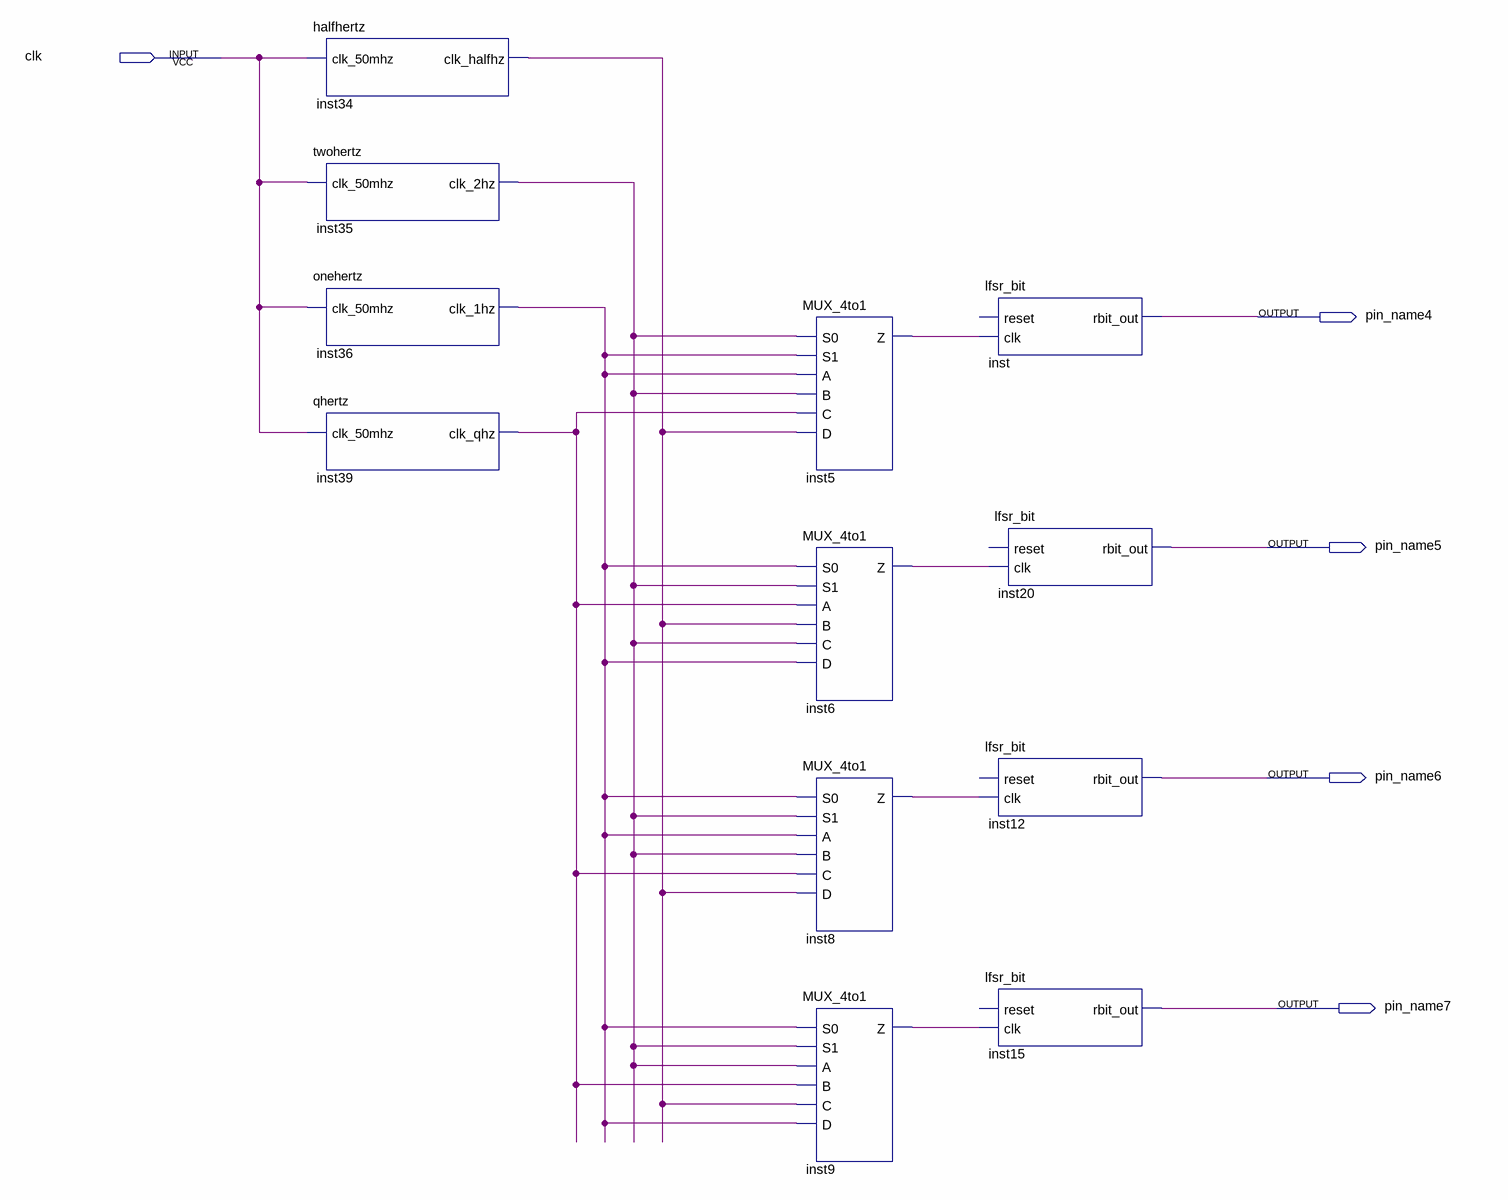
[diagram p0: schematic sheet]
// Quartus schematic rand_4bit.bdf as structural Verilog: 12 symbols, 5 pins
module rand_4bit (
  input  clk,
  output pin_name4,
  output pin_name5,
  output pin_name6,
  output pin_name7
);

  wire inst5_z, inst6_z, inst8_z, inst9_z, inst34_clk_halfhz, inst35_clk_2hz, inst36_clk_1hz, inst39_clk_qhz;

  halfhertz inst34 (.clk_50mhz(clk), .clk_halfhz(inst34_clk_halfhz));
  twohertz inst35 (.clk_50mhz(clk), .clk_2hz(inst35_clk_2hz));
  onehertz inst36 (.clk_50mhz(clk), .clk_1hz(inst36_clk_1hz));
  qhertz inst39 (.clk_50mhz(clk), .clk_qhz(inst39_clk_qhz));
  MUX_4to1 inst5 (
    .S0(inst35_clk_2hz), .S1(inst36_clk_1hz), .A(inst36_clk_1hz), .B(inst35_clk_2hz), .C(inst39_clk_qhz),
    .D(inst34_clk_halfhz), .Z(inst5_z));
  MUX_4to1 inst6 (
    .S0(inst36_clk_1hz), .S1(inst35_clk_2hz), .A(inst39_clk_qhz), .B(inst34_clk_halfhz), .C(inst35_clk_2hz),
    .D(inst36_clk_1hz), .Z(inst6_z));
  MUX_4to1 inst8 (
    .S0(inst36_clk_1hz), .S1(inst35_clk_2hz), .A(inst36_clk_1hz), .B(inst35_clk_2hz), .C(inst39_clk_qhz),
    .D(inst34_clk_halfhz), .Z(inst8_z));
  MUX_4to1 inst9 (
    .S0(inst36_clk_1hz), .S1(inst35_clk_2hz), .A(inst35_clk_2hz), .B(inst39_clk_qhz), .C(inst34_clk_halfhz),
    .D(inst36_clk_1hz), .Z(inst9_z));
  lfsr_bit inst (.clk(inst5_z), .rbit_out(pin_name4));  // open: reset
  lfsr_bit inst12 (.clk(inst8_z), .rbit_out(pin_name6));  // open: reset
  lfsr_bit inst15 (.clk(inst9_z), .rbit_out(pin_name7));  // open: reset
  lfsr_bit inst20 (.clk(inst6_z), .rbit_out(pin_name5));  // open: reset
endmodule
